# EAGLE design herald_rev_b (EAGLE 8.6.0)

## Sheet 1 of 2
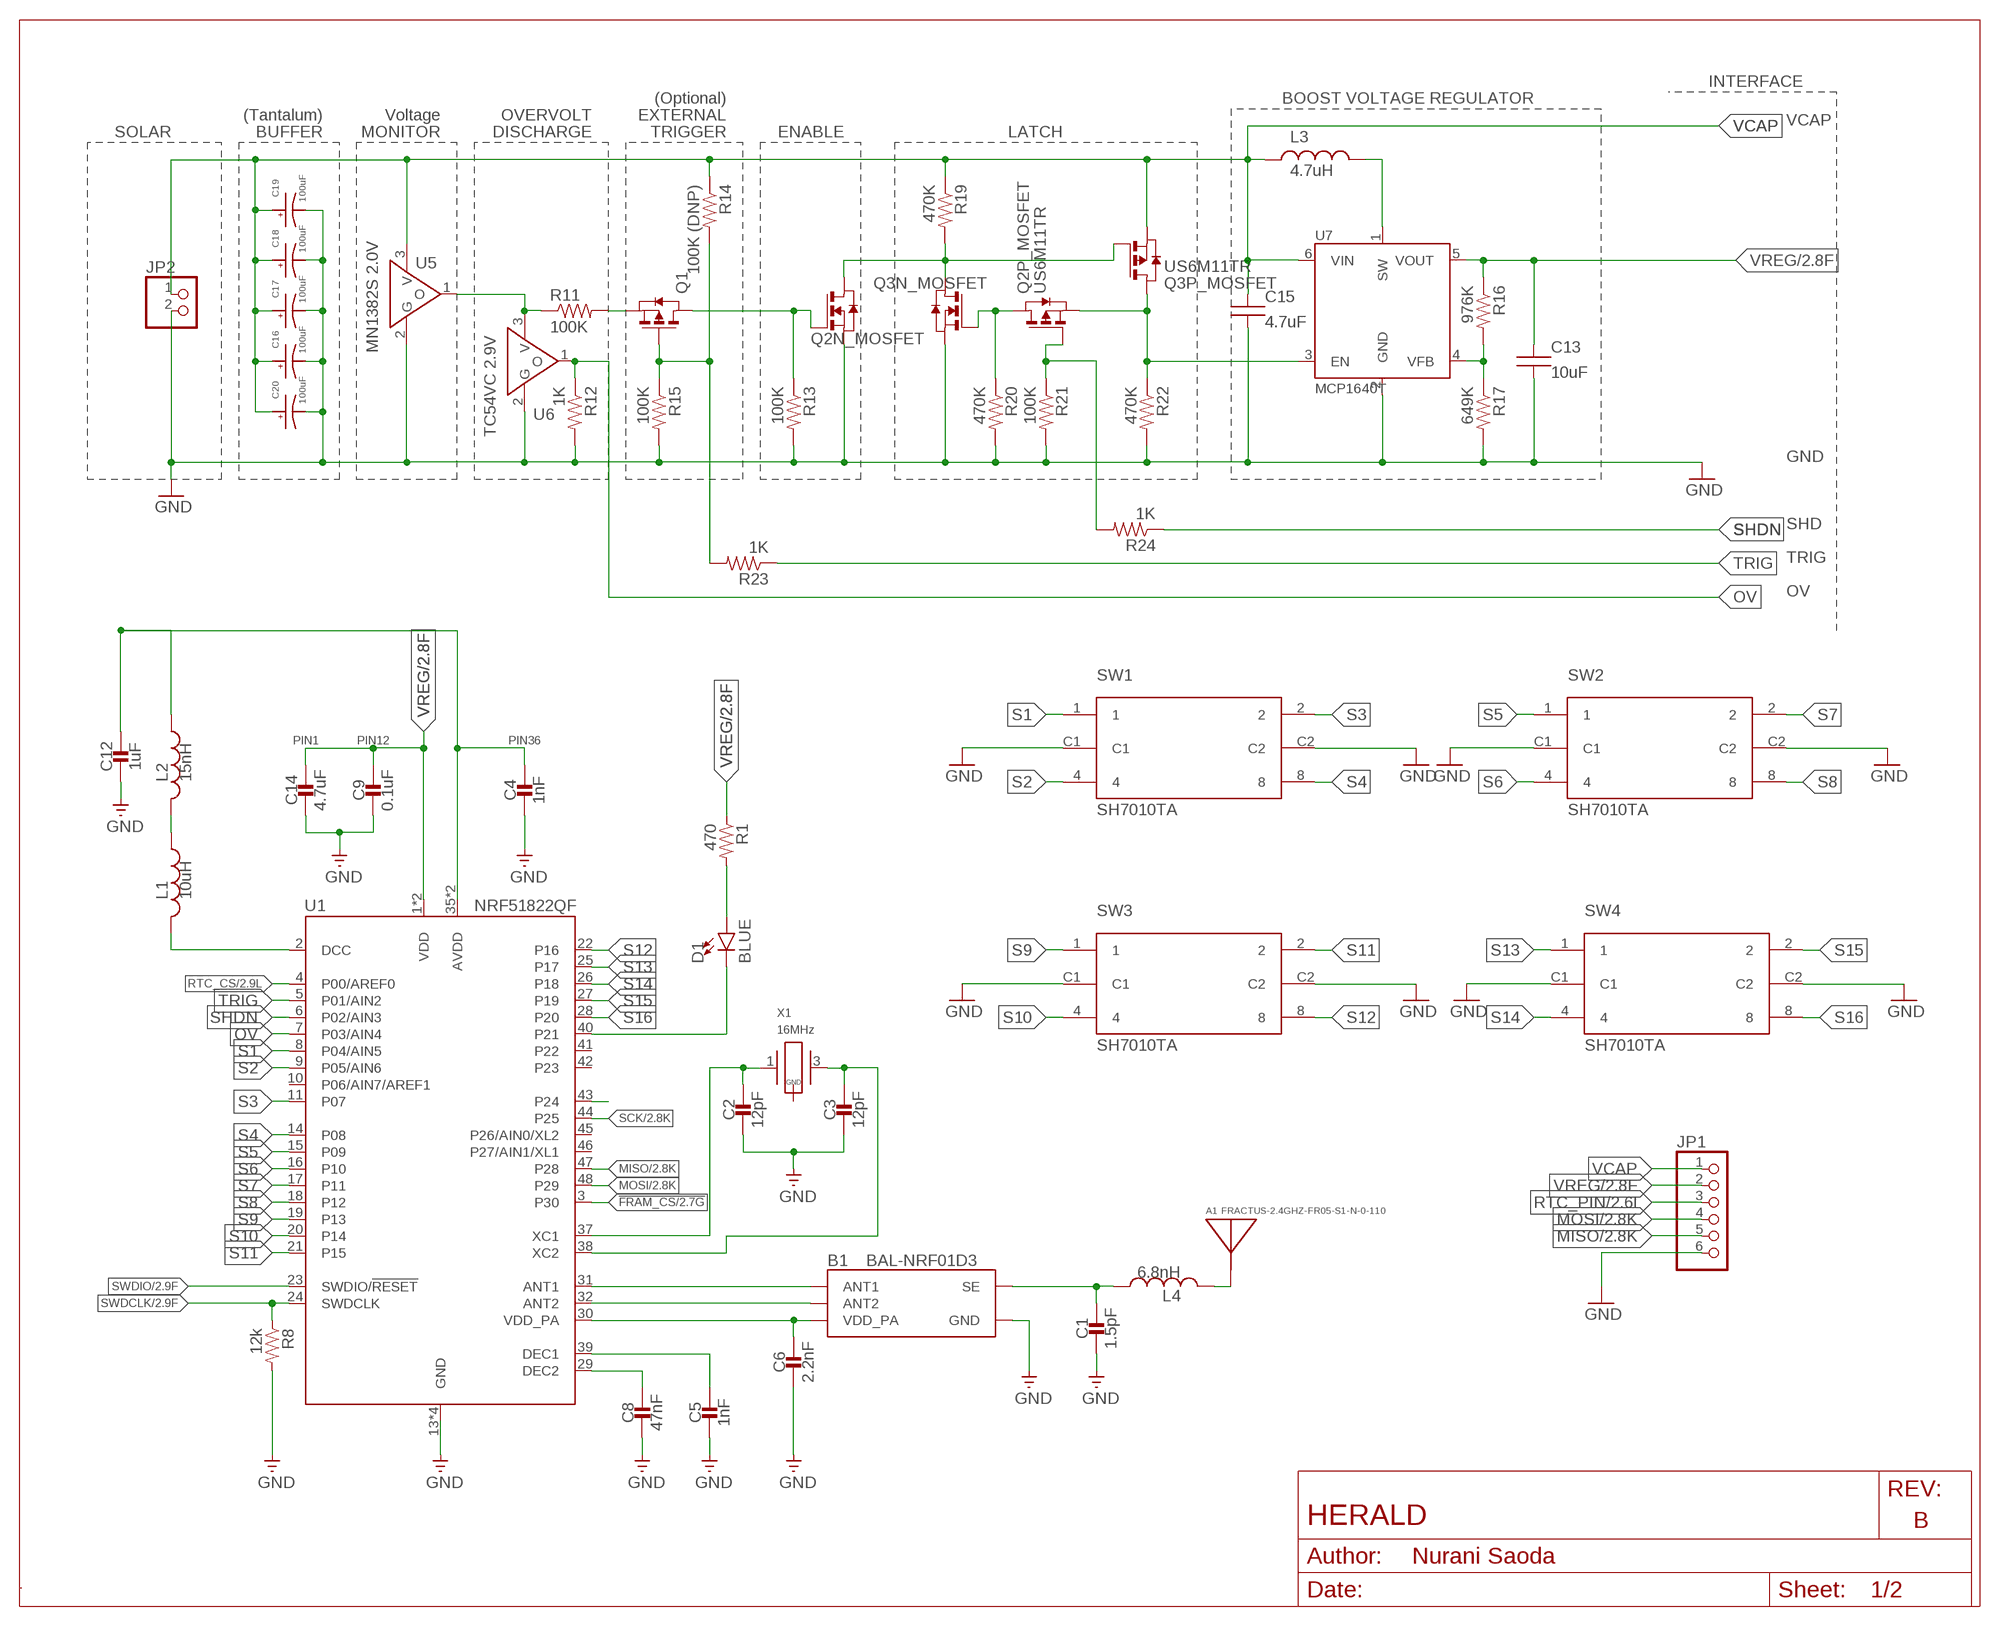
[diagram p0: schematic, sheet 1]
FRAME1 (LETTER_L_BLANK): AUTHOR: Nurani Saoda; REV: B; TITLE: HERALD

### Parts
A1  FRACTUS-2.4GHZ-FR05-S1-N-0-110  [FRACTUS-ANTENNA-FR05-S1-N-0-110]
B1  BAL-NRF01D3  [BAL-NRF01D3]
C1  1.5pF  CAPACITOR0402_CAP  [0402_CAP]
C2  12pF  CAPACITOR0402_CAP  [0402_CAP]
C3  12pF  CAPACITOR0402_CAP  [0402_CAP]
C4  1nF  CAPACITOR0402_CAP  [0402_CAP]
C5  1nF  CAPACITOR0402_CAP  [0402_CAP]
C6  2.2nF  CAPACITOR0402_CAP  [0402_CAP]
C8  47nF  CAPACITOR0402_CAP  [0402_CAP]
C9  0.1uF  CAPACITOR0402_CAP  [0402_CAP]
C12  1uF  CAPACITOR0402_CAP  [0402_CAP]
C13  10uF  CAP  [R0603B]
C14  4.7uF  CAPACITOR0402_CAP  [0402_CAP]
C15  4.7uF  CAP  [R0603B]
C16  100uF  1210_CAP_POLARIZED  [CAP1210]
C17  100uF  1210_CAP_POLARIZED  [CAP1210]
C18  100uF  1210_CAP_POLARIZED  [CAP1210]
C19  100uF  1210_CAP_POLARIZED  [CAP1210]
C20  100uF  1210_CAP_POLARIZED  [CAP1210]
D1  BLUE  LED-BLUE0603  [LED-0603]
JP1  PINHD-1X6  [1X06]
JP2  PINHD-1X2  [1X02]
L1  10uH  INDUCTOR0603  [0603_CAP]
L2  15nH  INDUCTOR0402  [0402_CAP]
L3  4.7uH  L-US  [L2828]
L4  6.8nH  INDUCTOR0402  [0402_CAP]
Q1  PMOSSOT23  [SOT-23]
Q2  US6M11TR  [TUMT6]
Q3  US6M11TR  [TUMT6]
R1  470  RESISTOR0402_RES  [0402_RES]
R8  12k  RESISTOR0402_RES  [0402_RES]
R11  100K  RESISTOR  [R0603B]
R12  1K  RESISTOR  [R0603B]
R13  100K  RESISTOR  [R0603B]
R14  100K (DNP)  RESISTOR  [R0603B]
R15  100K  RESISTOR  [R0603B]
R16  976K  RESISTOR  [R0603B]
R17  649K  RESISTOR  [R0603B]
R19  470K  RESISTOR  [R0603B]
R20  470K  RESISTOR  [R0603B]
R21  100K  RESISTOR  [R0603B]
R22  470K  RESISTOR  [R0603B]
R23  1K  RESISTOR  [R0603B]
R24  1K  RESISTOR  [R0603B]
SW1  SH7010TA  [SWTICH-6]
SW2  SH7010TA  [SWTICH-6]
SW3  SH7010TA  [SWTICH-6]
SW4  SH7010TA  [SWTICH-6]
U1  NRF51822QF  [QFN-48-6MM]
U5  MN1382S 2.0V  MN1382S  [MINI-3DC]
U6  TC54VC 2.9V  MN1382S  [MINI-3DC]
U7  MCP1640T  MCP1640  [SOT-23-6]
X1  16MHz  TXC-8Y  [TXC-8Y]

### Nets
!FRAM2_CS: U1.43(P24)
!FRAM_CS: U1.3(P30) ; also sheet 2
GND: B1.GND C1.2 C2.2 C3.2 C4.2 C5.2 C6.2 C8.2 C9.2 C12.2 C13.2 C14.2 C15.2 C16.ANODE C17.ANODE C18.ANODE C19.ANODE C20.ANODE JP1.6 JP2.2 Q2.1(N_MOSFET:S) Q3.1(N_MOSFET:S) R8.2 R12.2 R13.2 R15.2 R17.2 R20.2 R21.2 R22.2 SW1.C1 SW1.C2 SW2.C1 SW2.C2 SW3.C1 SW3.C2 SW4.C1 SW4.C2 U1.13(GND) U1.33(GND) U1.34(GND) U1.GND U5.2(G) U6.2(G) U7.2(GND) ; also sheet 2
MISO: JP1.5 U1.47(P28) ; also sheet 2
MOSI: JP1.4 U1.48(P29) ; also sheet 2
N$1: A1.ANT(ANTENNA) L4.2
N$4: Q2.6(N_MOSFET:D) Q3.5(P_MOSFET:G) Q3.6(N_MOSFET:D) R19.2
N$5: B1.ANT1 U1.31(ANT1)
N$6: B1.ANT2 U1.32(ANT2)
N$7: D1.C U1.40(P21)
N$8: D1.A R1.2
N$10: Q2.4(P_MOSFET:S) Q3.3(P_MOSFET:D) R22.1 U7.3(EN)
N$11: B1.SE C1.1 L4.1
N$12: C4.1 C12.1 L2.1 U1.35(AVDD) U1.36(AVDD)
N$13: L1.2 U1.2(DCC)
N$14: L1.1 L2.2
N$16: C2.1 U1.37(XC1) X1.1
N$17: C3.1 U1.38(XC2) X1.3
N$18: C5.1 U1.39(DEC1)
N$19: C8.1 U1.29(DEC2)
N$20: R16.2 R17.1 U7.4(VFB)
N$21: L3.2 U7.1(SW)
N$24: Q2.3(P_MOSFET:D) Q3.2(N_MOSFET:G) R20.1
N$25: Q2.5(P_MOSFET:G) R21.1 R24.2
N$26: Q1.1(D) Q2.2(N_MOSFET:G) R13.1
N$28: R11.1 U5.1(O) U6.3(V)
N$29: Q1.3(G) R14.2 R15.1 R23.2
N$30: Q1.2(S) R11.2
OV: R12.1 U1.7(P03/AIN4) U6.1(O)
RTC_CS: U1.4(P00/AREF0) ; also sheet 2
RTC_PIN: JP1.3 ; also sheet 2
S1: SW1.1 U1.8(P04/AIN5)
S2: SW1.4 U1.9(P05/AIN6)
S3: SW1.2 U1.11(P07)
S4: SW1.8 U1.14(P08)
S5: SW2.1 U1.15(P09)
S6: SW2.4 U1.16(P10)
S7: SW2.2 U1.17(P11)
S8: SW2.8 U1.18(P12)
S9: SW3.1 U1.19(P13)
S10: SW3.4 U1.20(P14)
S11: SW3.2 U1.21(P15)
S12: SW3.8 U1.22(P16)
S13: SW4.1 U1.25(P17)
S14: SW4.4 U1.26(P18)
S15: SW4.2 U1.27(P19)
S16: SW4.8 U1.28(P20)
SCK: U1.44(P25) ; also sheet 2
SHDN: R24.1 U1.6(P02/AIN3)
SWDCLK: R8.1 U1.24(SWDCLK) ; also sheet 2
SWDIO: U1.23(SWDIO/!RESET) ; also sheet 2
TRIG: R23.1 U1.5(P01/AIN2)
VCAP: C15.1 C16.CATHODE C17.CATHODE C18.CATHODE C19.CATHODE C20.CATHODE JP1.1 JP2.1 L3.1 Q3.4(P_MOSFET:S) R14.1 R19.1 U5.3(V) U7.6(VIN)
VDD_PA: B1.VCC(VDD_PA) C6.1 U1.30(VDD_PA)
VREG: C9.1 C13.1 C14.1 JP1.2 R1.1 R16.1 U1.1(VDD) U1.12(VDD) U7.5(VOUT) ; also sheet 2
Unconnected: U1.10(P06/AIN7/AREF1) U1.41(P22) U1.42(P23) U1.45(P26/AIN0/XL2) U1.46(P27/AIN1/XL1) X1.2(GND) X1.4(GND)

### Notes on the sheet
- INTERFACE
- (Optional) | BOOST VOLTAGE REGULATOR
- (Tantalum) | Voltage | OVERVOLT | EXTERNAL
- SOLAR | BUFFER | MONITOR | DISCHARGE | TRIGGER | ENABLE | LATCH | VCAP
- GND
- SHD
- TRIG
- OV
- PIN1 | PIN12 | PIN36

## Sheet 2 of 2
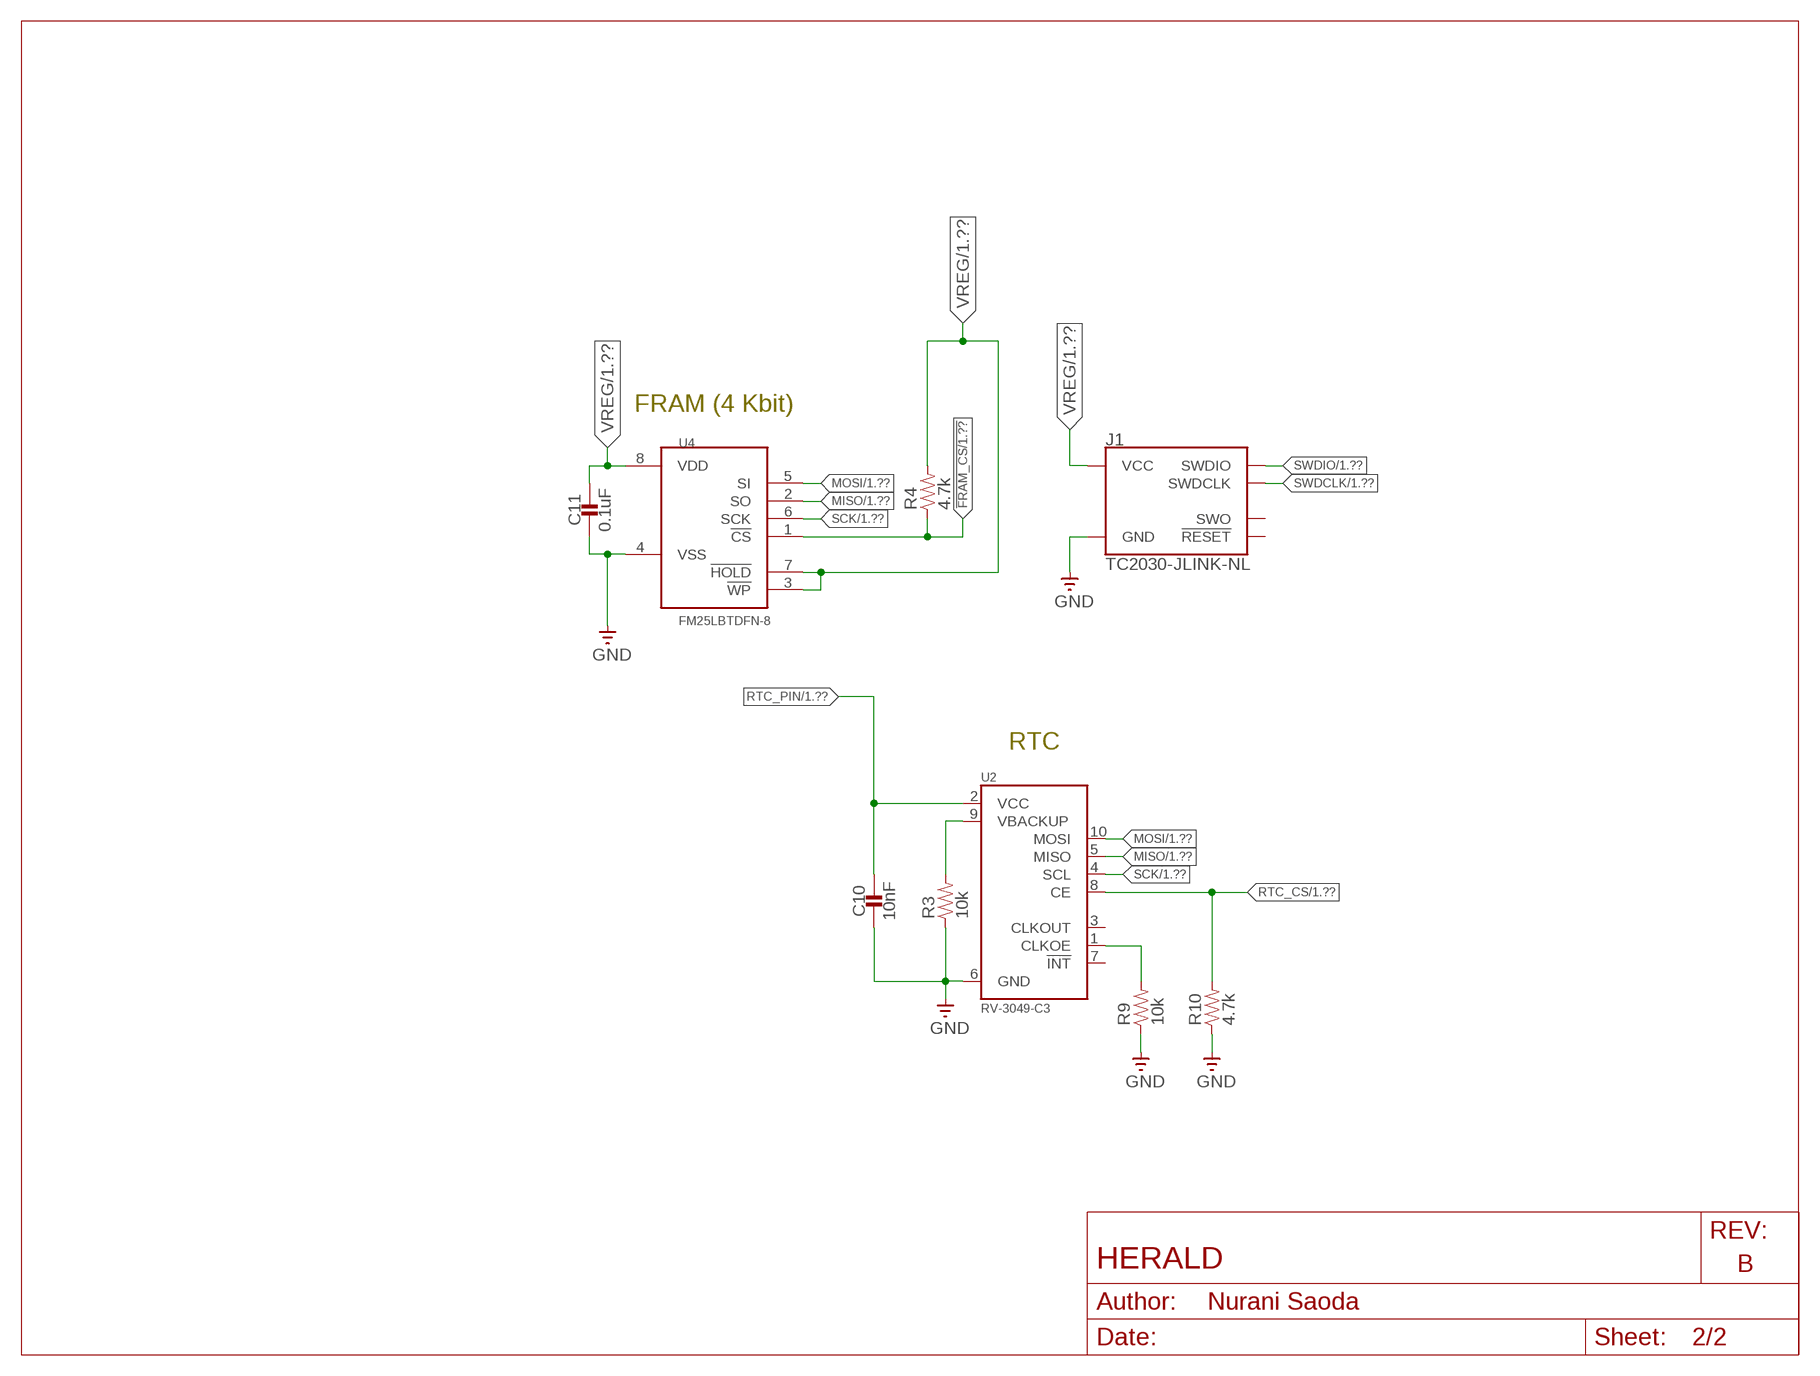
[diagram p1: schematic, sheet 2]
FRAME2 (LETTER_L_BLANK): AUTHOR: Nurani Saoda; REV: B; TITLE: HERALD

### Parts
C10  10nF  CAPACITOR0402_CAP  [0402_CAP]
C11  0.1uF  CAPACITOR0402_CAP  [0402_CAP]
J1  TC2030-JLINK-NL  [TC2030-IDC-NL]
R3  10k  RESISTOR0402_RES  [0402_RES]
R4  4.7k  RESISTOR0402_RES  [0402_RES]
R9  10k  RESISTOR0402_RES  [0402_RES]
R10  4.7k  RESISTOR0402_RES  [0402_RES]
U2  RV-3049-C3  [MICRO-CRYSTAL-C3]
U4  FM25LBTDFN-8  [TDFN-8@1]

### Nets
!FRAM_CS: R4.1 U4.1(!CS) ; also sheet 1
GND: C10.2 C11.2 J1.5(GND) R3.1 R9.1 R10.1 U2.6(GND) U4.4(VSS) ; also sheet 1
MISO: U2.5(MISO) U4.2(SO) ; also sheet 1
MOSI: U2.10(MOSI) U4.5(SI) ; also sheet 1
N$2: R3.2 U2.9(VBACKUP)
N$3: R9.2 U2.1(CLKOE)
RTC_CS: R10.2 U2.8(CE) ; also sheet 1
RTC_PIN: C10.1 U2.2(VCC) ; also sheet 1
SCK: U2.4(SCL) U4.6(SCK) ; also sheet 1
SWDCLK: J1.4(SWDCLK) ; also sheet 1
SWDIO: J1.2(SWDIO) ; also sheet 1
VREG: C11.1 J1.1(VCC) R4.2 U4.3(!WP) U4.7(!HOLD) U4.8(VDD) ; also sheet 1
Unconnected: J1.3(!RESET) J1.6(SWO) U2.3(CLKOUT) U2.7(!INT)

### Notes on the sheet
- FRAM (4 Kbit)
- RTC

## Library data of the parts
A1 = chips:FRACTUS-2.4GHZ-FR05-S1-N-0-110: Fractus Micro Reach Xtend Requires matching network.; RICHARDSON_RFPD: FR05-S1-N-0110B
B1 = chips:BAL-NRF01D3: 50 ohm nominal input / conjugate match balun to nRF51422-QFAA, nRF24LE1, nRF51822-QFAA/AB, with integrated harmonic filter; DIGIKEY: 497-13637-1-ND; MANUFACTURER: STMicroelectronics; MOUSER: 511-BAL-NRF01D3; MPN: BAL-NRF01D3
C1-C6 C8-C12 C14 = passives:CAPACITOR: SMD Capacitor
C13 C15 = Gecko:CAP
C16-C20 = Gecko:1210_CAP_POLARIZED
D1 = SparkFun-LED:LED-BLUE: Blue SMD LED Used in manufacturing of various products at SparkFun Packages: 0603 - SMD 0603 package [Product Link] <http://www.digikey.com/product-detail/en/SMLE12BC7TT86/511-1589-2-ND/1641808> 1206 - SMD1206 package [Product Link] <http://www.digikey.com/product-detail/en/lite-on-inc/LTST-C150TBKT/160-1643-1-ND/573584> SparkFun Products: ESP8266 Thing-Dev Board <https://www.sparkfun.com/products/13711> RedBoard <https://www.sparkfun.com/products/12757>; PROD_ID: DIO-08575
J1 = connector:TC2030-JLINK
JP1 = pinhead:PINHD-1X6: PIN HEADER
JP2 = pinhead:PINHD-1X2: PIN HEADER
L1 = passives:INDUCTOR: A very specific inductor; DIGIKEY: 490-4025-1-ND
L2 L4 = passives:INDUCTOR: A very specific inductor; DIGIKEY: 587-1521-1-ND
L3 = Gecko:L-US
Q1 = berkeley-epic:PMOSSOT23: MOS FET
Q2 Q3 = DUALMOS:US6M11TR; DIGIKEY: US6M11CT-ND
R1 = passives:RESISTOR: Resistor Basic schematic elements and footprints for 0603, 1206, and PTH resistors.; DIGIKEY: RHM470CECT-ND
R3 R9 = passives:RESISTOR: Resistor Basic schematic elements and footprints for 0603, 1206, and PTH resistors.; DIGIKEY: RHM10KCECT-ND
R4 R10 = passives:RESISTOR: Resistor Basic schematic elements and footprints for 0603, 1206, and PTH resistors.; DIGIKEY: RHM4.7KCECT-ND
R8 = passives:RESISTOR: Resistor Basic schematic elements and footprints for 0603, 1206, and PTH resistors.; DIGIKEY: RHM12.0KCDCT-ND
R11-R17 R19-R24 = Gecko:RESISTOR
SW1-SW4 = sh7010TA:SH7010TA; DIGIKEY: 563-1207-2-ND
U1 = chips:NRF51822: Multiprotocol Bluetooth® 4.0 low energy/2.4 GHz RF SoC; DIGIKEY: 1490-1042-1-ND; MANUFACTURER: Nordic Semi; MOUSER: 949-NRF51822-QFAC-R7; MPN: NRF51822-QFAC-R7
U2 = chips:RV-3049-C3: The RV-3049-C3 is an ultra miniature Real-Time-Clock Module with embedded Crystal. This RTC has an SPI Bus (4-wire Serial- Interface) and offers temperature compensated time.; NEWARK: RV-3049-C3
U4 = chips:FM25LB: IC FRAM 4KBIT 10MHZ 8SOIC; DIGIKEY: FM25L04B-DGRA-ND; MOUSER: 877-FM25L04B-DG
U5 U6 = umich:MN1382S
U7 = Gecko:MCP1640
X1 = crystals:TXC-8Y: 2mmx1.6mm SMD Crystal; DIGIKEY: 887-2003-1-ND

## Board
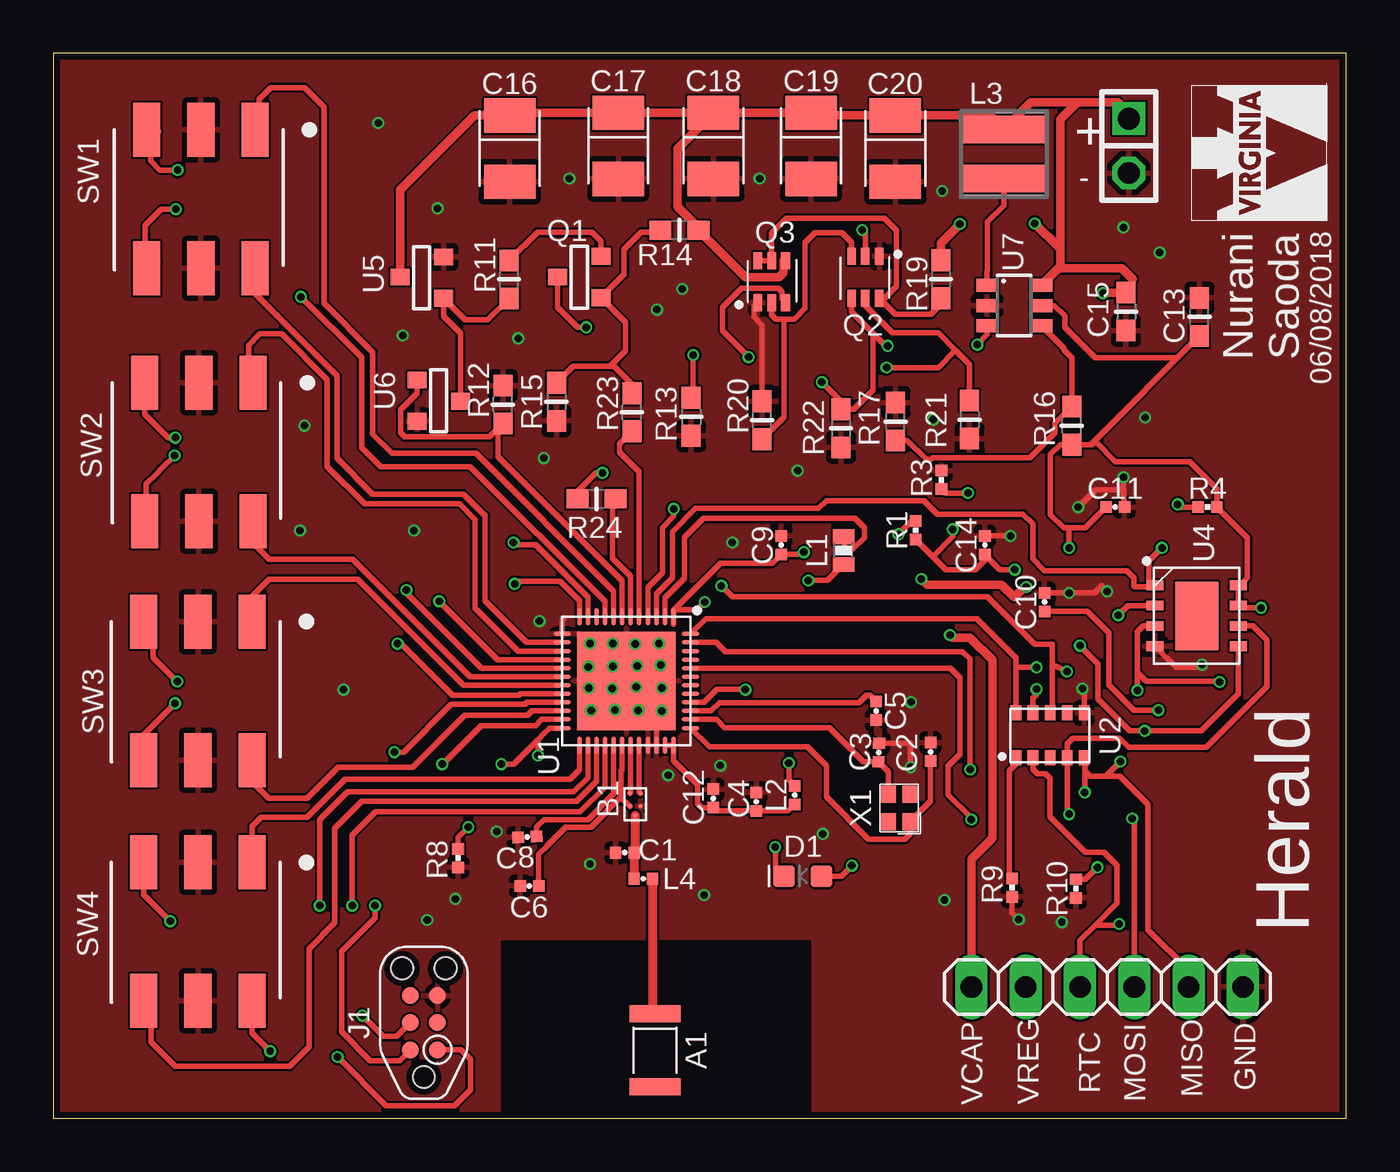
[diagram p2: board, top side]
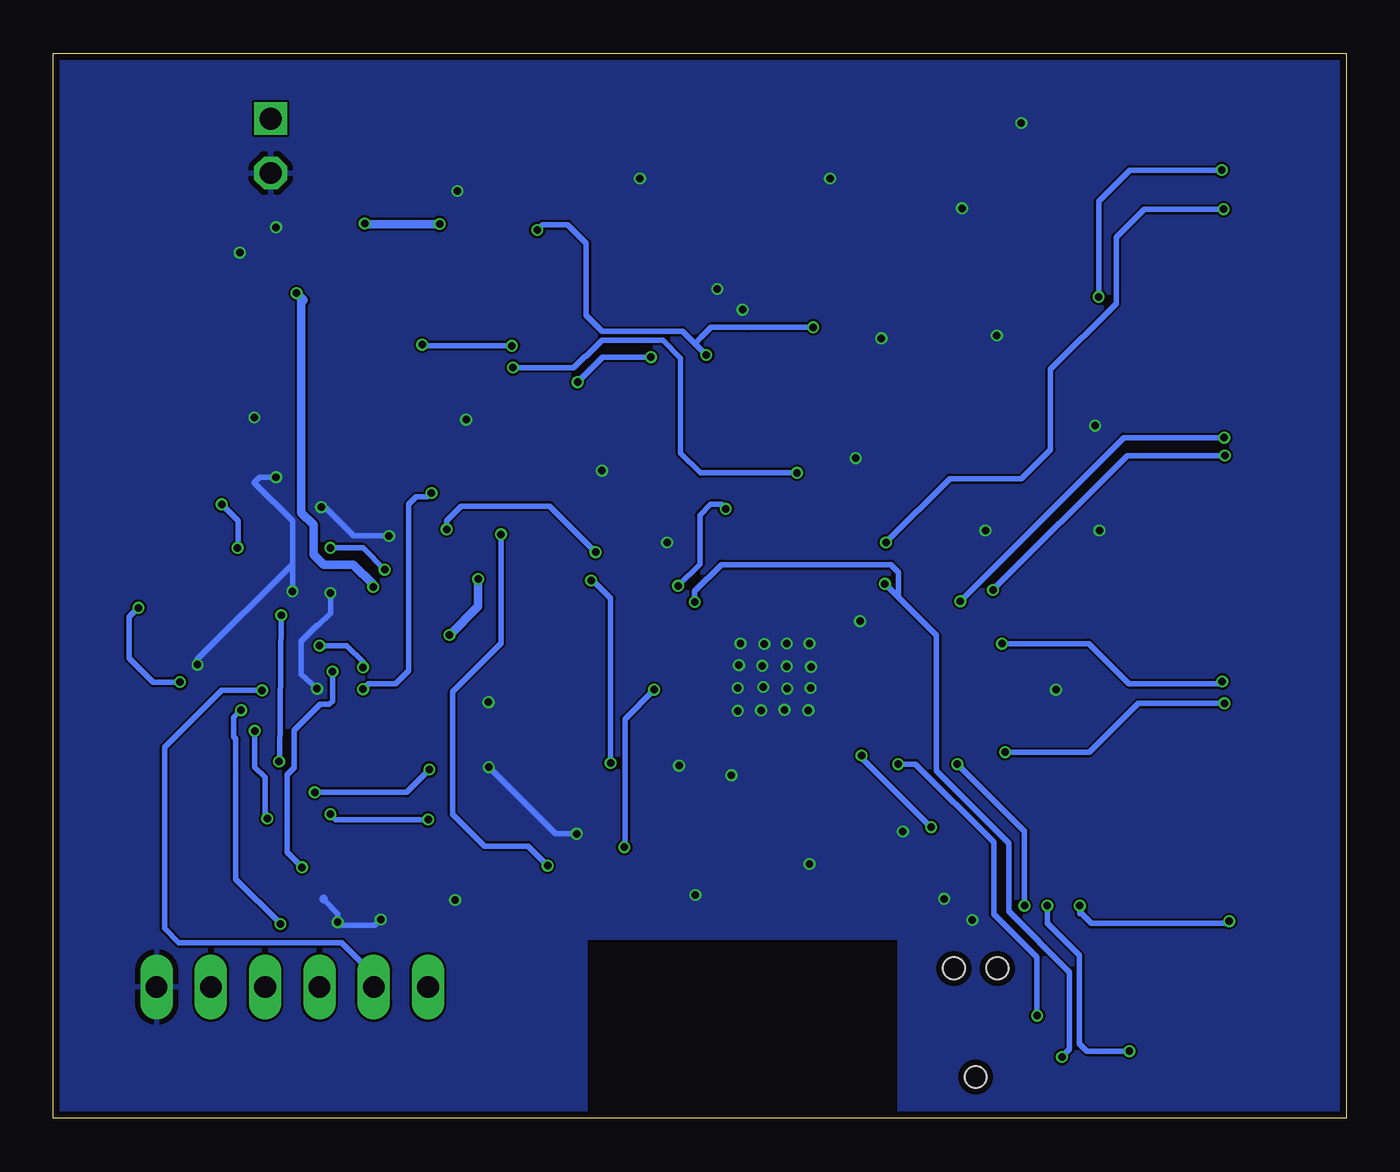
[diagram p3: board, bottom side, seen from below]

Size 60.45 x 49.78 mm. Coordinates in mm from the lower left corner, seen from the top.
Outline: 0,49.78 0,0 60.45,0 60.45,49.78 0,49.78
Copper layers (1*16): Top 0.0178mm / dielectric 59mil / Bottom 0.0178mm
Design rules "quickturn_co_kr_1oz *": minimum track width 4mil, minimum drill 0.200659375mm, track to track 4mil, track to pad 6mil, pad to pad 6mil, via to via 6mil, smd to smd 6mil, copper to edge 12mil, drill to drill 12mil, minimum pad ring 8mil, minimum via ring 4mil, stop-mask expansion 3mil, vias tented up to drill 50mil, thermal gap 10mil

### Footprints (pad centres in the part's own frame; a part is rotated, then mirrored left to right if it is on the bottom)
FRACTUS-ANTENNA-FR05-S1-N-0-110 = smd 0.8 x 2.4: ANT -1.7,0; NULL 1.7,0
BAL-NRF01D3 = smd 0.22 x 0.22: ANT1 -0.517,-0.25; ANT2 -0.517,0.25; GND 0.083,0.25; SE 0.516,0; VCC 0.083,-0.25
0402_CAP = smd 0.536 x 0.546: 1 -0.433,0; 2 0.433,0
R0603B = smd 1.016 x 0.889: 1 -0.889,0; 2 0.889,0
CAP1210 = smd 2.4 x 1.6: ANODE 0,-1.55; CATHODE 0,1.55
LED-0603 = smd 1 x 1: A -0.877,0; C 0.877,0
TC2030-IDC-NL = smd 0.787 x 0.787: 1 -1.27,-0.635; 2 -1.27,0.635; 3 0,-0.635; 4 0,0.635; 5 1.27,-0.635; 6 1.27,0.635 | hole 1.016: -2.54,0; 2.54,1.016; 2.54,-1.016
1X06 = drill 1.016 long: 1 -6.35,0; 2 -3.81,0; 3 -1.27,0; 4 1.27,0; 5 3.81,0; 6 6.35,0
1X02 = drill 1.016 square: 1 -1.27,0 | drill 1.016 octagon: 2 1.27,0
0603_CAP = smd 0.7 x 1: 1 -0.65,0; 2 0.65,0
L2828 = smd 1.27 x 3.81: 1 -1.143,0; 2 1.143,0
SOT-23 = smd 0.787 x 0.889: 1 0.025,-1.016; 2 -0.94,1.016; 3 0.991,1.016
TUMT6 = smd 0.4 x 0.8: 1 -0.65,-0.65; 2 0,-0.65; 3 0.65,-0.65; 4 0.65,1.3; 5 0,1.3; 6 -0.65,1.3
0402_RES = smd 0.536 x 0.546: 1 -0.433,0; 2 0.433,0
SWTICH-6 = smd 2.54 x 1.27: 1 0,2.54; 2 6.477,-2.54; 4 0,-2.54; 8 6.477,2.54; C1 0,0; C2 6.477,0
QFN-48-6MM = smd 0.8 x 0.203: 1 -3,2.2; 2 -3,1.8; 3 -3,1.4; 4 -3,1; 5 -3,0.6; 6 -3,0.2; 7 -3,-0.2; 8 -3,-0.6; 9 -3,-1; 10 -3,-1.4; 11 -3,-1.8; 12 -3,-2.2; 25 3,-2.2; 26 3,-1.8; 27 3,-1.4; 28 3,-1; 29 3,-0.6; 30 3,-0.2; 31 3,0.2; 32 3,0.6; 33 3,1; 34 3,1.4; 35 3,1.8; 36 3,2.2 | smd 0.203 x 0.8: 13 -2.2,-3; 14 -1.8,-3; 15 -1.4,-3; 16 -1,-3; 17 -0.6,-3; 18 -0.2,-3; 19 0.2,-3; 20 0.6,-3; 21 1,-3; 22 1.4,-3; 23 1.8,-3; 24 2.2,-3; 37 2.2,3; 38 1.8,3; 39 1.4,3; 40 1,3; 41 0.6,3; 42 0.2,3; 43 -0.2,3; 44 -0.6,3; 45 -1,3; 46 -1.4,3; 47 -1.8,3; 48 -2.2,3 | smd 4.6 x 4.6: GND 0,0
MICRO-CRYSTAL-C3 = smd 0.5 x 0.7: 1 -1.6,-1.05; 2 -0.8,-1.05; 3 0,-1.05; 4 0.8,-1.05; 5 1.6,-1.05; 6 1.6,1.05; 7 0.8,1.05; 8 0,1.05; 9 -0.8,1.05; 10 -1.6,1.05
TDFN-8@1 = smd 0.45 x 0.8: 1 -1.425,-1.95; 2 -0.475,-1.95; 3 0.475,-1.95; 4 1.425,-1.95; 5 1.425,1.95; 6 0.475,1.95; 7 -0.475,1.95; 8 -1.425,1.95 | smd 3.2 x 2: NC 0,0
MINI-3DC = smd 0.787 x 0.889: 1 -0.991,-1.016; 2 0.94,-1.016; 3 0,1.016
SOT-23-6 = smd 0.61 x 1.016: 1 -0.953,-1.27; 2 0,-1.27; 3 0.953,-1.27; 4 0.953,1.27; 5 0,1.27; 6 -0.953,1.27
TXC-8Y = smd 0.8 x 0.7: 1 -0.65,-0.5; 2 0.65,-0.5; 3 0.65,0.5; 4 -0.65,0.5

### Placement (x,y rotation side)
A1  28.14,3.18 270 top
B1  27.2,14.68 270 top
C1  26.72,12.42 180 top
C2  41.02,17.13 90 top
C3  38.6,17.11 87.7 top
C4  32.87,14.8 90 top
C5  38.48,19.05 270 top
C6  22.26,10.86 180 top
C8  22.16,13.16 183.2 top
C9  34.04,26.8 90 top
C10  46.35,24.13 90 top
C11  49.66,28.57 0 top
C12  30.86,14.96 90 top
C13  53.59,37.47 90 top
C14  43.56,26.8 90 top
C15  50.16,37.72 270 top
C16  21.34,45.34 0 top
C17  26.42,45.47 0 top
C18  30.86,45.47 0 top
C19  35.43,45.47 0 top
C20  39.37,45.34 0 top
D1  35.05,11.33 180 top
J1  17.32,4.47 90 top
JP1  49.28,6.14 0 top
JP2  50.29,45.47 270 top
L1  36.96,26.54 90 top
L2  34.67,15.11 90 top
L3  44.45,45.09 270 top
L4  27.58,11.2 0 top
Q1  24.59,39.36 270 top
Q2  37.97,39.65 180 top
Q3  33.59,38.79 0 top
R1  40.32,27.5 90 top
R3  41.53,29.84 270 top
R4  53.98,28.57 0 top
R8  18.92,12.17 270 top
R9  44.83,10.79 90 top
R10  47.82,10.74 90 top
R11  21.31,39.22 90 top
R12  21.02,33.37 90 top
R13  29.83,32.8 270 top
R14  29.27,41.53 180 top
R15  23.52,33.5 270 top
R16  47.62,32.38 90 top
R17  39.38,32.58 90 top
R19  41.5,39.23 270 top
R20  33.15,32.64 90 top
R21  42.84,32.67 270 top
R22  36.83,32.26 270 top
R23  27.05,33.01 90 top
R24  25.4,28.96 180 top
SW1  6.9,46.22 270 top
SW2  6.8,34.39 270 top
SW3  6.76,23.22 270 top
SW4  6.76,11.97 270 top
U1  26.8,20.45 270 top
U2  46.61,17.91 0 top
U4  53.47,23.5 270 top
U5  17.22,39.33 90 top
U6  18.01,33.53 270 top
U7  44.93,38 270 top
X1  39.55,14.51 90 top

### Tracks (layer width: path | path; a pad name or v marks a point on that pad's centre or on a via)
!FRAM_CS  (via drill 0.35)
  Top 0.254: U1.3 28.2,24.51 28.96,25.27 28.96,27.43 30.04,28.51 35.78,28.51 36.14,28.88 40.72,28.88 41.35,28.25 45.34,28.25 45.8,27.79 45.8,26.16 46.35,25.6 50.19,25.6 50.52,25.27 50.52,24.89 50.57,24.84 51.23,24.84 | 51.23,24.84 51.44,24.84 U4.1 | R4.1 52.7,28.57 v52.58,28.7 | v51.84,26.67 51.23,26.06 51.23,24.84
  Bottom 0.254: v52.58,28.7 51.82,27.94 51.82,26.67 v51.84,26.67
GND  (via drill 0.35)
  Top 0.254: U1.13 23.8,23.29 23.88,23.37 | C14.2 v44.76,27.23 | v47.93,28.57 48.74,29.39 50.06,29.39 50.06,28.96 | 50.06,28.96 50.06,28.6 C11.2 | C10.2 v47.5,24.56 48.69,24.56 49.02,24.89 v49.28,24.64 | v50.04,29.97 50.04,28.98 50.06,28.96 | U4.4 52.51,21.08 53.85,21.08 v53.72,21.21 | 28.2,18.55 v28.45,19.05 | 28.14,18.49 v28.45,19.05 | C3.2 40.09,17.54 v40.09,16.41 | U2.6 48.21,20.09 v48.13,20.09 | U1.34 28.2,18.8 v28.45,19.05 | R20.2 33.15,37.08 32.77,37.47 32.77,37.97 Q3.1 | R9.1 44.83,9.61 v45.15,9.3
  Bottom 0.254: v44.76,27.23 46.41,27.23 47.8,28.63 47.88,28.63 v47.93,28.57 | v49.28,24.64 49.28,25.91 | 49.28,25.91 49.28,27.94 51.05,29.72 50.8,29.97 v50.04,29.97 | v53.72,21.21 53.72,21.46 49.28,25.91 | v40.09,16.41 36.98,13.3 v35.98,13.3 | 47.82,10.24 47.16,9.58 v47.16,9.17 | 47.02,9.02 45.42,9.02 v45.15,9.3 | v48.13,20.09 48.87,20.75 48.87,22.3 48.11,23.05 48.06,23.05 47.5,23.62 v47.5,24.56
  Bottom 0.406: 47.82,10.24 47.82,10.26
  other vias: 41.15,32.66 24.13,43.94 33.02,43.94 31.75,26.92 21.74,36.47 25.1,22.2 26.16,22.2 27.2,22.17 28.32,22.2 25.02,21.11 26.16,21.13 27.3,21.16 28.4,21.18 25.04,20.12 26.14,20.09 27.25,20.17 28.45,20.12 25.15,19.08 26.26,19.1 27.36,19.08 50.04,41.66 51.05,32.77 13.57,20.04 29.41,38.77 28.23,37.81 51.74,40.47 28.75,16.04 41.67,10.21 31.19,16.48 41.56,43.35 22.73,23.24 25.1,11.89 20.73,13.41 18.8,10.26 17.48,9.27 30.43,10.44 40.11,19.46 34.8,30.28 15.19,46.53 11.53,27.48 11.73,32.38 16.33,36.6 22.94,30.86 16.87,27.48 17.96,42.55
  pour Top: -1.71,52.66 -1.71,-1.71 -1.57,-1.85 20.78,-1.85 20.78,8.43 35.56,8.48 35.56,-1.83 63.08,-1.83 63.08,52.66
  pour Bottom: -3.05,53.9 -3.01,-3.15 20.85,-3.15 20.85,8.43 35.59,8.46 35.59,-3.3 64.47,-3.3 64.47,53.9
MISO  (via drill 0.35)
  Top 0.254: U1.47 30.99,22.25 31.42,21.82 42.52,21.82 42.85,21.49 42.85,16.33 v42.88,16.31 | v48.23,15.24 48.23,16.26 | 48.23,16.26 48.23,16.83 U2.5 | 48.23,16.26 48.49,16 49.22,16 | JP1.5 53.09,6.92 51.19,8.81 51.19,14.68 49.87,16 49.22,16 | v49.9,16.68 49.22,16 | v49.8,23.52 50.25,23.97 U4.2
  Bottom 0.254: v42.88,16.31 43.94,15.24 v48.23,15.24 | v49.8,23.52 49.87,16.71 v49.9,16.68
MOSI  (via drill 0.35)
  Top 0.254: U1.48 30.52,23.37 43.18,23.37 45.01,21.54 45.01,21.08 | 45.01,21.08 U2.10 | U4.5 55.42,19.86 53.68,18.12 v51.03,18.12 50.35,18.12 48.84,19.62 48.84,21.26 v48.01,22.1 | v45.97,21.08 45.01,21.08 | JP1.4 50.55,13.91 v50.45,14.01
  Bottom 0.254: v48.01,22.1 46.74,22.1 45.97,21.34 v45.97,21.08 | v50.45,14.01 50.56,14.12 50.56,15.94 51.03,16.41 v51.03,18.12
N$1
  Top 0.254: 28.02,5 A1.ANT
  Top 0.432: L4.2 28.02,5
N$2  (via drill 0.35)
  Top 0.254: U2.9 45.81,19.65 45.97,19.81 v45.97,20.07 | v42.77,29.23 41.71,29.23 R3.2
  Bottom 0.254: v45.97,20.07 45.72,20.32 44.45,20.32 43.84,20.93 43.84,28.7 43.48,29.06 42.95,29.06 v42.77,29.23
N$3
  Top 0.254: U2.1 45.01,16.56 44.7,16.26 44.7,11.35 R9.2
N$4
  Top 0.254: Q3.6 Q3.5 33.59,41.38 34.29,42.09 38.86,42.09 39.42,41.53 39.42,38.91 38.86,38.35 Q2.6 39.38,37.59 41.05,37.59 41.5,38.05 R19.2
N$5
  Top 0.254: U1.31 27,15.24 B1.ANT1
N$6
  Top 0.254: U1.32 27.4,15.26 B1.ANT2
N$7  (via drill 0.35)
  Top 0.254: U1.40 30.42,19.45 31.04,20.07 32.33,20.07 v32.36,20.04 | v33.76,12.68 33.76,11.75 D1.C
  Bottom 0.254: v32.36,20.04 33.73,18.67 33.73,12.7 v33.76,12.68
N$8  (via drill 0.35)
  Top 0.254: D1.A 36.85,11.33 v37.34,11.81 | v39.52,27.3 40.15,27.93 R1.2
  Bottom 0.254: v37.34,11.81 38.25,12.72 40.28,12.72 41.78,14.22 41.78,19.94 39.52,22.2 v39.52,27.3
N$10  (via drill 0.35)
  Top 0.254: Q2.4 37.32,37.71 38.33,36.7 | 38.33,36.7 38.33,34.04 37.44,33.15 R22.1 36.83,33.53 v35.94,34.42 | 38.33,36.7 38.91,36.12 v39.01,36.12 | v43.2,36.17 43.66,36.63 U7.3 | Q3.3 34.06,38.31 34.06,38.65 33.9,38.81 32.19,38.81 31.29,37.92 31.29,36.83 32.51,35.61 v32.51,35.59
  Bottom 0.254: v39.01,36.12 43.16,36.12 v43.2,36.17 | v32.51,35.59 34.77,35.59 v35.94,34.42
N$11
  Top 0.254: 27.2,12.47 C1.1
  Top 0.432: B1.SE 27.2,12.47 | C1.1 L4.1
N$12
  Top 0.254: U1.35 U1.36 29,16.72 30.12,15.6 30.12,14.71 30.3,14.53 C12.1 31.02,14.37 C4.1 | 32.45,14.37 C4.1 | C4.1 34.36,14.37 L2.1
N$13
  Top 0.254: 28.62,23.47 U1.2 28.6,24.33 29.52,25.25 29.52,27.18 30.39,28.05 35.97,28.05 35.97,28.06 37.48,28.06 37.92,27.62 37.92,27.15 37.35,26.57 37,26.57 37,27.15 L1.2
N$14  (via drill 0.35)
  Top 0.254: L2.2 34.39,15.82 v34.39,16.61 | v35.31,25.15 36.21,25.15 L1.1
  Bottom 0.254: v34.39,16.61 34.39,24.31 35.23,25.15 v35.31,25.15
N$16
  Top 0.254: U1.37 30.67,17.37 35.26,17.37 36.14,16.48 36.14,15.04 38.12,13.06 39.83,13.06 40.05,13.28 X1.1 41.02,14.83 C2.1
N$17
  Top 0.254: U1.38 31.01,18.65 31.39,18.26 36.3,18.26 37.88,16.67 C3.1 39.05,16.2 X1.3
N$18
  Top 0.254: U1.39 30.76,19.05 31.14,19.43 37.67,19.43 38.02,19.79 38.18,19.79 C5.1
N$19
  Top 0.254: U1.29 26.2,15.17 24.99,13.97 22.94,13.97 22.59,13.62 C8.1
N$20
  Top 0.254: R17.1 39.94,31.69 40.82,30.8 41.05,30.8 41.12,30.88 45.66,30.88 46.84,32.05 46.84,32.49 R16.2 47.62,35.57 47.25,35.94 47.25,36 U7.4
N$21
  Top 0.254: L3.2 44.45,42.67 43.69,41.91 43.69,39.62 43.66,39.6 U7.1
N$24
  Top 0.254: 33.22,31.67 R20.1 34.16,32.77 34.16,37.36 | Q2.3 37.32,40.96 36.88,41.4 35.61,41.4 35.15,40.95 35.15,37.87 34.65,37.36 34.16,37.36 | 34.16,37.36 33.78,37.36 33.58,37.57 33.58,38.13 Q3.2
N$25  (via drill 0.35)
  Top 0.254: Q2.5 37.97,38 39.24,36.73 41.38,36.73 42.19,35.92 | R21.1 42.84,35.26 42.19,35.92 | R24.2 24.51,29.31 25.38,30.18 v25.68,30.18 | v38.96,35.1 41.38,35.1 42.19,35.92
  Bottom 0.254: v25.68,30.18 30.2,30.18 31.11,31.09 31.11,35.53 31.95,36.37 34.8,36.37 35.53,35.64 35.59,35.64 36.12,35.1 v38.96,35.1
N$26  (via drill 0.35)
  Top 0.254: Q2.2 37.97,41.38 v37.82,41.53 | v29.92,35.69 29.92,33.79 R13.1 | Q1.1 23.57,37.92 24.51,36.98 v24.92,36.98
  Bottom 0.254: v37.82,41.53 37.57,41.78 36.4,41.78 35.53,40.92 35.53,37.54 34.8,36.8 31.04,36.8 30.45,36.22 | 30.45,36.22 v29.92,35.69 | v24.92,36.98 27.94,36.98 27.96,36.98 29.69,36.98 29.96,36.72 30.16,36.51 30.45,36.22
N$28
  Top 0.254: R11.1 20.31,37.33 19.25,37.33 U5.1 18.24,37.5 19.03,36.7 U6.3
N$29
  Top 0.254: R14.2 28.29,41.43 27.48,41.43 26.69,40.64 26.69,39.45 25.83,38.59 | 25.83,38.59 Q1.3 26.76,37.21 26.76,35.88 26.04,35.17 | 25.86,38.59 25.83,38.59 | 26.04,35.17 26.21,35.17 27.05,34.32 R23.2 | 26.04,35.17 24.3,35.17 R15.1
N$30
  Top 0.254: R11.2 22.64,41.43 25.18,41.43 25.6,41.01 Q1.2
OV
  Top 0.254: U1.7 26.6,25.12 20.79,30.93 20.79,32.25 | U6.1 17,33.89 16.22,33.12 16.22,32.06 16.42,31.86 20.4,31.86 20.79,32.25 | R12.1 20.92,32.38 20.79,32.25
RTC_CS  (via drill 0.35)
  Top 0.254: v31.24,24.89 31.75,24.38 43.69,24.38 45.9,22.17 46.71,22.17 46.71,21.13 | 46.71,21.13 46.71,19.06 U2.8 | U1.4 27.8,24.82 28.47,25.5 28.47,27.61 29.01,28.14 v29.01,28.5 | v48.83,11.73 48.27,11.18 R10.2 | v47.4,20.89 46.9,21.13 46.71,21.13
  Bottom 0.254: v31.24,24.89 30.23,25.91 30.23,28.19 29.72,28.7 29.21,28.7 v29.01,28.5 | v47.4,20.89 47.4,19.51 47.56,19.35 47.98,19.35 49.19,18.14 49.19,16.39 49.52,16.05 49.52,12.43 v48.83,11.73
RTC_PIN  (via drill 0.35)
  Top 0.254: JP1.3 48.01,8.32 48.72,9.03 | 48.72,9.03 49.74,10.04 49.74,11.82 49.12,12.44 48.27,12.44 46.6,14.11 46.6,15.91 46.39,16.12 46.01,16.12 45.81,16.32 U2.2 | 48.72,9.03 49.77,9.03 v49.84,9.09 | v51.68,19.08 50.53,19.08 49.35,20.26 49.35,22.7 48.35,23.7 C10.1
  Bottom 0.254: v49.84,9.09 51.92,11.18 51.92,17.74 52.03,17.85 52.03,18.75 v51.68,19.08
S1
  Top 0.254: U1.8 26.2,24.64 19.75,31.08 15.84,31.08 14.94,31.99 14.94,35.83 12.65,38.11 12.65,47.28 11.75,48.17 10.15,48.17 9.63,47.65 9.63,46.41 SW1.1
S2  (via drill 0.35)
  Top 0.254: U1.9 25.8,24.16 19.49,30.47 15.29,30.47 14.4,31.36 14.4,35.57 v11.57,38.41 | v5.81,44.34 4.98,44.34 4.55,44.77 4.55,45.77 4.92,46.14 SW1.4
  Bottom 0.254: v11.57,38.41 11.57,42.88 10.11,44.34 v5.81,44.34
S3  (via drill 0.35)
  Top 0.254: U1.11 25,24.37 22.54,26.82 21.61,26.82 v21.51,26.92 | 5.63,42.51 v5.73,42.51 5.04,42.51 4.29,41.76 4.29,39.99 4.48,39.8 | 4.88,40 4.48,39.8 | 4.48,39.8 SW1.2
  Bottom 0.254: v21.51,26.92 18.53,29.91 15.18,29.91 13.82,31.27 13.82,35.01 10.74,38.09 10.74,41.2 9.44,42.51 v5.73,42.51
S4
  Top 0.254: U1.14 22.13,22.25 20.19,24.19 20.19,28.17 19.18,29.18 14.94,29.18 13.26,30.86 13.26,34.73 9.44,38.55 SW1.8
S5
  Top 0.254: U1.15 21.74,21.85 19.73,23.86 19.73,27.98 18.99,28.73 14.55,28.73 12.8,30.47 12.8,34.54 10.66,36.68 9.65,36.68 9.12,36.14 9.12,34.61 SW2.1
S6  (via drill 0.35)
  Top 0.254: v18.04,24.17 20.77,21.45 U1.16 | v5.7,31.82 5.37,31.82 4.26,32.92 SW2.4 4.67,34.96
  Bottom 0.254: v18.04,24.17 10.39,31.82 v5.7,31.82
S7  (via drill 0.35)
  Top 0.254: U1.17 20.01,21.05 16.51,24.55 v16.51,24.7 | v5.66,30.99 5.12,30.44 4.77,30.1 4.34,29.67 4.34,28 SW2.2
  Bottom 0.254: v5.66,30.99 10.22,30.99 v16.51,24.7
S8
  Top 0.254: U1.18 19.49,20.65 14,26.14 10.08,26.14 9.34,26.88 SW2.8
S9
  Top 0.254: U1.19 19.17,20.25 14.22,25.2 10.08,25.2 9.3,24.41 SW3.1
S10  (via drill 0.35)
  Top 0.254: U1.20 21.83,19.85 21.77,19.79 18.68,19.79 16.27,22.19 v16.09,22.19 | v5.79,20.42 4.67,21.54 4.67,23.83 SW3.4
  Bottom 0.254: v16.09,22.19 12.03,22.19 10.16,20.32 5.89,20.32 v5.79,20.42
S11  (via drill 0.35)
  Top 0.254: U1.21 22.14,19.45 22.05,19.36 18.61,19.36 16.37,17.12 v15.95,17.12 | v5.69,19.41 4.22,17.93 SW3.2
  Bottom 0.254: v15.95,17.12 12,17.12 9.72,19.41 v5.69,19.41
S12
  Top 0.254: U1.22 22.37,19.05 22.17,18.85 19.23,18.85 16.79,16.41 13.31,16.41 11.86,14.96 10.06,14.96 9.22,15.8 9.3,15.88 SW3.8
S13
  Top 0.254: U1.25 24.6,16.29 24.16,15.85 13.64,15.85 11.86,14.07 9.7,14.07 9.3,13.67 SW4.1
S14  (via drill 0.35)
  Top 0.254: U1.26 25,15.93 24.33,15.27 13.77,15.27 12.45,13.95 v12.45,9.94 | SW4.4 4.22,10.46 v5.46,9.22
  Bottom 0.254: v12.45,9.94 12.45,9.65 | 12.45,9.65 12.45,9.56 | 12.45,9.65 11.92,9.12 5.56,9.12 v5.46,9.22
S15
  Top 0.254: U1.27 25.4,15.77 24.49,14.86 24.49,14.83 14.41,14.83 13.14,13.56 13.14,10.25 13.16,10.24 13.16,9.13 11.96,7.93 11.96,3.34 11.05,2.43 5.7,2.43 4.57,3.56 4.57,5.83 SW4.2
S16  (via drill 0.35)
  Top 0.254: U1.28 25.8,15.48 24.64,14.33 15.06,14.33 13.97,13.23 v13.97,9.94 | v10.13,3.14 9.3,3.98 SW4.8
  Bottom 0.254: v13.97,9.94 13.97,9.11 12.47,7.61 12.47,3.48 12.13,3.14 v10.13,3.14
SCK  (via drill 0.35)
  Top 0.254: U1.44 41.95,21.05 42.39,20.6 42.39,17.02 41.83,16.46 41.83,15.14 42.9,14.07 42.9,13.99 v42.93,13.97 | v47.5,14.22 47.41,14.31 U2.4 47.41,17.51 47.68,17.78 49.86,17.78 50.3,17.34 53.92,17.34 56.74,20.17 56.74,22.38 56.1,23.02 U4.6
  Bottom 0.254: v42.93,13.97 47.24,13.97 v47.5,14.22
SHDN
  Top 0.254: R24.1 26.43,28.82 26.14,28.53 26.14,26.19 27,25.33 U1.6
SWDCLK  (via drill 0.35)
  Top 0.254: v14.45,4.8 15.41,3.83 16.05,3.83 J1.4 | v20.95,16.56 21.51,16.56 22.66,17.7 | U1.24 23.2,18.25 22.95,18 22.66,17.7 | R8.1 18.92,13.13 v19.41,13.61 | v22.66,16.97 22.66,17.7
  Bottom 0.254: v14.45,4.8 14.45,7.53 16.47,9.55 16.47,12.9 20.13,16.56 v20.95,16.56 | v19.41,13.61 22.66,16.87 v22.66,16.97
SWDIO  (via drill 0.35)
  Top 0.254: U1.23 22.84,18.65 22.55,18.36 20,18.36 v18.19,16.56 v18.18,16.56 | J1.2 16.18,2.69 14.82,2.69 13.47,4.04 13.47,7.82 15.04,9.39 v15.04,9.95
  Bottom 0.254: v18.18,16.56 15.04,13.42 v15.04,9.95
TRIG
  Top 0.254: U1.5 27.4,30.22 26.48,31.14 26.48,31.55 R23.1
VCAP  (via drill 0.35)
  Top 0.254: C16.CATHODE 21.46,47.02 | C19.CATHODE 35.56,46.89 | 50.49,39.19 50.48,39.16 | 50.48,39.16 C15.1 | 50.29,46.99 JP2.1 | U7.6 47,39.74 | 50.48,39.23 50.48,39.16 | v49.09,38.58 49.12,38.61
  Top 0.406: 21.46,47.02 C17.CATHODE C18.CATHODE | C18.CATHODE C19.CATHODE | 35.56,46.89 C20.CATHODE 43.79,46.89 L3.1 45.72,47.5 47.88,47.5 | C16.CATHODE 19.69,46.89 16.2,43.41 U5.3 | 47.88,47.5 49.78,47.5 50.29,46.99 | C18.CATHODE 29.18,45.34 29.18,42.62 30.16,41.64 R14.1 32.36,39.33 33.93,39.33 34.14,39.54 34.14,40.09 34.19,40.13 Q3.4 | 47,39.74 49.96,39.74 50.48,39.23 | U7.6 47.09,39.84 47.09,40.72 | 47.88,47.5 47.09,46.71 47.09,40.72 | 42.93,7.25 JP1.1 42.93,12.12 43.91,13.1 43.91,21.44 42.87,22.48 42.04,22.48 v41.93,22.59 | 49.12,38.61 C15.1 | v40.59,25.22 40.85,24.96 44.34,24.96 44.93,24.36 45.41,24.84 v45.5,24.84 | R19.1 41.5,40.92 v42.39,41.81 | v45.9,41.83 47.02,40.72 47.09,40.72
  Bottom 0.406: 48.75,38.24 v49.09,38.58 48.86,38.35 48.86,28.32 48.28,27.74 48.28,26.34 47.82,25.89 46.43,25.89 45.5,24.96 v45.5,24.84 | v41.93,22.59 40.59,23.93 v40.59,25.22 | v42.39,41.81 45.87,41.81 v45.9,41.83
VDD_PA
  Top 0.254: U1.30 26.6,16.29 26.55,16.24 26.55,15.03 | 26.55,15.03 25.14,13.61 23.96,13.61 23.08,12.74 23.08,12.73 22.69,12.34 C6.1 | B1.VCC 26.55,15 26.55,15.03
VREG  (via drill 0.35)
  Top 0.254: 48.56,31.5 48.72,31.65 49.66,30.7 53.14,30.7 54.41,29.44 R4.2 55.84,27.15 55.84,25.28 55.45,24.89 U4.8 U4.7 55.52,23.87 v56.48,23.87 | 48.56,31.5 R16.1 47.09,31.5 46.63,31.04 46.63,28.22 47.24,27.61 47.5,27.61 | C11.1 48.26,27.61 47.5,27.61 | C14.1 43.66,26.26 | 43.66,26.26 44.27,25.65 v44.96,25.65 | v47.5,26.67 47.5,27.61 | U7.5 46.81,38 47.3,37.52 47.3,36.98 48.72,35.56 52.58,35.56 C13.1 48.56,31.55 48.56,31.5 | R1.1 41.12,26.26 | 41.12,26.26 41.73,25.65 43.13,25.65 43.66,26.19 43.66,26.26 | v50.69,20.01 50.69,20.85 | 50.69,20.85 50.69,22.74 50.97,23.02 U4.3 | 50.69,20.85 51.11,20.43 54.5,20.43 v54.53,20.4 | U1.12 24.6,24.2 23.69,25.11 21.69,25.11 v21.57,24.99 | 29.03,23.78 29,23.75 U1.1 29,23.1 | 29.03,23.78 31.2,25.95 33.62,25.95 C9.1 34.99,26.36 v35.1,26.47 | v42.06,27.54 42.06,27.2 41.12,26.26 | 29.03,23.78 30.1,23.78 v30.46,24.14 | J1.1 19.07,3.2 19.52,2.76 19.52,1.34 18.77,0.59 15.56,0.59 v13.28,2.87
  Bottom 0.254: v44.96,25.65 45.97,26.67 v47.5,26.67 | v13.28,2.87 12.93,3.23 12.93,6.83 15.78,9.68 15.78,12.86 19.16,16.24 19.16,22.57 20.94,24.36 | v50.69,20.01 52.59,20.01 55.26,17.34 55.26,8.88 54.6,8.22 46.97,8.22 45.47,6.72 JP1.2 | v54.53,20.4 55.79,20.4 56.91,21.52 56.91,23.45 56.5,23.87 v56.48,23.87 | v21.57,24.99 20.94,24.36 | v35.1,26.47 37.25,28.62 41.38,28.62 42.06,27.94 v42.06,27.54 | v30.46,24.14 30.46,24.64 29.22,25.89 21.29,25.89 20.94,25.54 20.94,24.36

### Text on the board
tPlace: + | - | C:/Users/ns8nf/Desktop/dada/logo1.bmp | 06/08/2018 | Nurani / Saoda
tNames: SW1 | SW2 | SW3 | Herald | SW4 | RTC | VCAP | VREG | MOSI | MISO | GND